# Altium schematic sheet 07_DADC.SchDoc
size 420 x 297 mm; SheetNumber: 7; SheetTotal: 12
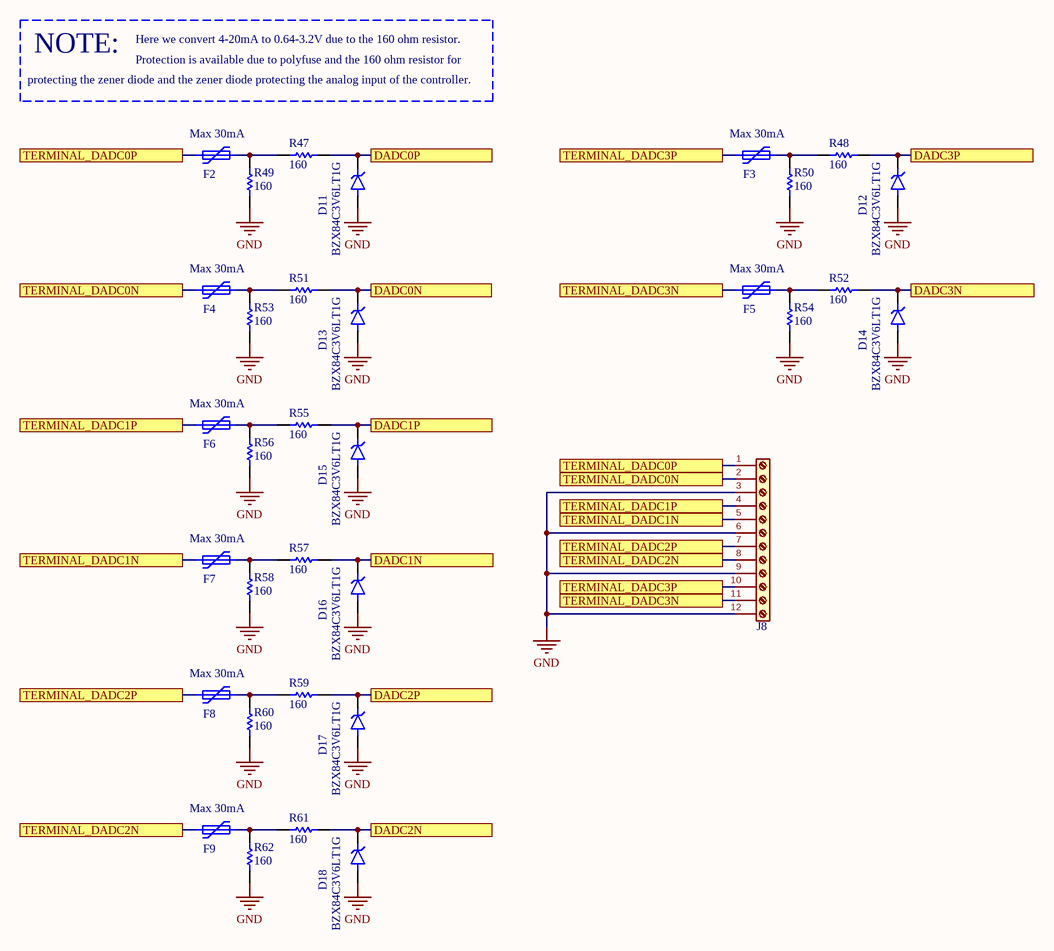
[diagram p0: 07_DADC.SchDoc]

## Parts
D11  BZX84C3V6LT1G  [SOT95P240X111-3N]
D12  BZX84C3V6LT1G  [SOT95P240X111-3N]
D13  BZX84C3V6LT1G  [SOT95P240X111-3N]
D14  BZX84C3V6LT1G  [SOT95P240X111-3N]
D15  BZX84C3V6LT1G  [SOT95P240X111-3N]
D16  BZX84C3V6LT1G  [SOT95P240X111-3N]
D17  BZX84C3V6LT1G  [SOT95P240X111-3N]
D18  BZX84C3V6LT1G  [SOT95P240X111-3N]
F2  Max 30mA  [Fuse_0603_1608Metric]
F3  Max 30mA  [Fuse_0603_1608Metric]
F4  Max 30mA  [Fuse_0603_1608Metric]
F5  Max 30mA  [Fuse_0603_1608Metric]
F6  Max 30mA  [Fuse_0603_1608Metric]
F7  Max 30mA  [Fuse_0603_1608Metric]
F8  Max 30mA  [Fuse_0603_1608Metric]
F9  Max 30mA  [Fuse_0603_1608Metric]
J8  Terminal_01x12_P5.00  [TerminalBlock_Phoenix_PT-1,5-12-5.0-H_1x12_P5.00mm_Horizontal]  (value not drawn)
R47  ValueDisplayed: 160  [0603]  (hidden comment: CRCW060320R0JNEA)
R48  ValueDisplayed: 160  [0603]  (hidden comment: CRCW060320R0JNEA)
R49  ValueDisplayed: 160  [0603]  (hidden comment: CRCW060320R0JNEA)
R50  ValueDisplayed: 160  [0603]  (hidden comment: CRCW060320R0JNEA)
R51  ValueDisplayed: 160  [0603]  (hidden comment: CRCW060320R0JNEA)
R52  ValueDisplayed: 160  [0603]  (hidden comment: CRCW060320R0JNEA)
R53  ValueDisplayed: 160  [0603]  (hidden comment: CRCW060320R0JNEA)
R54  ValueDisplayed: 160  [0603]  (hidden comment: CRCW060320R0JNEA)
R55  ValueDisplayed: 160  [0603]  (hidden comment: CRCW060320R0JNEA)
R56  ValueDisplayed: 160  [0603]  (hidden comment: CRCW060320R0JNEA)
R57  ValueDisplayed: 160  [0603]  (hidden comment: CRCW060320R0JNEA)
R58  ValueDisplayed: 160  [0603]  (hidden comment: CRCW060320R0JNEA)
R59  ValueDisplayed: 160  [0603]  (hidden comment: CRCW060320R0JNEA)
R60  ValueDisplayed: 160  [0603]  (hidden comment: CRCW060320R0JNEA)
R61  ValueDisplayed: 160  [0603]  (hidden comment: CRCW060320R0JNEA)
R62  ValueDisplayed: 160  [0603]  (hidden comment: CRCW060320R0JNEA)

## Ports
DADC0N (see 04_STM32F303VCT6[2B]), DADC0P (see 04_STM32F303VCT6[2B]), DADC1N (see 04_STM32F303VCT6[2B]), DADC1P (see 04_STM32F303VCT6[2B]), DADC2N (see 04_STM32F303VCT6[5C]), DADC2P (see 04_STM32F303VCT6[5C]), DADC3N (see 04_STM32F303VCT6[5C]), DADC3P (see 04_STM32F303VCT6[5C]), TERMINAL_DADC0N (see 07_DADC[1A]), TERMINAL_DADC0N (see 07_DADC[2B]), TERMINAL_DADC0P (see 07_DADC[1A]), TERMINAL_DADC0P (see 07_DADC[2B]), TERMINAL_DADC1N (see 07_DADC[1B]), TERMINAL_DADC1N (see 07_DADC[2B]), TERMINAL_DADC1P (see 07_DADC[1B]), TERMINAL_DADC1P (see 07_DADC[2B]), TERMINAL_DADC2N (see 07_DADC[1C]), TERMINAL_DADC2N (see 07_DADC[2B]), TERMINAL_DADC2P (see 07_DADC[1B]), TERMINAL_DADC2P (see 07_DADC[2B]), TERMINAL_DADC3N (see 07_DADC[2A]), TERMINAL_DADC3N (see 07_DADC[2B]), TERMINAL_DADC3P (see 07_DADC[2A]), TERMINAL_DADC3P (see 07_DADC[2B])

## Nets
GND: D11.1(A) D12.1(A) D13.1(A) D14.1(A) D15.1(A) D16.1(A) D17.1(A) D18.1(A) J8.3(Pin_3) J8.6(Pin_6) J8.9(Pin_9) J8.12(Pin_12) R49.1 R50.1 R53.1 R54.1 R56.1 R58.1 R60.1 R62.1
DADC0N: D13.3(K) R51.2 ; port DADC0N
DADC0P: D11.3(K) R47.2 ; port DADC0P
DADC1N: D16.3(K) R57.2 ; port DADC1N
DADC1P: D15.3(K) R55.2 ; port DADC1P
DADC2N: D18.3(K) R61.2 ; port DADC2N
DADC2P: D17.3(K) R59.2 ; port DADC2P
DADC3N: D14.3(K) R52.2 ; port DADC3N
DADC3P: D12.3(K) R48.2 ; port DADC3P
TERMINAL_DADC0N: F4.1 J8.2(Pin_2) ; port TERMINAL_DADC0N
TERMINAL_DADC0P: F2.1 J8.1(Pin_1) ; port TERMINAL_DADC0P
TERMINAL_DADC1N: F7.1 J8.5(Pin_5) ; port TERMINAL_DADC1N
TERMINAL_DADC1P: F6.1 J8.4(Pin_4) ; port TERMINAL_DADC1P
TERMINAL_DADC2N: F9.1 J8.8(Pin_8) ; port TERMINAL_DADC2N
TERMINAL_DADC2P: F8.1 J8.7(Pin_7) ; port TERMINAL_DADC2P
TERMINAL_DADC3N: F5.1 J8.11(Pin_11) ; port TERMINAL_DADC3N
TERMINAL_DADC3P: F3.1 J8.10(Pin_10) ; port TERMINAL_DADC3P
NetF2_2: F2.2 R47.1 R49.2
NetF3_2: F3.2 R48.1 R50.2
NetF4_2: F4.2 R51.1 R53.2
NetF5_2: F5.2 R52.1 R54.2
NetF6_2: F6.2 R55.1 R56.2
NetF7_2: F7.2 R57.1 R58.2
NetF8_2: F8.2 R59.1 R60.2
NetF9_2: F9.2 R61.1 R62.2

## Notes on the sheet
- Here we convert 4-20mA to 0.64-3.2V due to the 160 ohm resistor.
- protecting the zener diode and the zener diode protecting the analog input of the controller.
- NOTE:
- Protection is available due to polyfuse and the 160 ohm resistor for
- Sub-system:
- Project:
- Design by:
- Sheet title:
- Sheet
- of
- Checked by:
- Approved by:
- Doc No:
- Revision:
- Size:
- Date:
- A3

## Library data of the parts
D11-D18 = BZX84C3V6LT1G: MP: BZX84C10LT1G; Package: None; Price: None; Value: *; Availability: Unavailable
F2-F9 = Polyfuse 0603
R47-R62 = RES 160R 0603: RES, 160, 5%, 0.1 W, AEC-Q200 Grade 0, 0603; Manufacturer: Vishay-Dale; Power_W: 100mW; TempCo: 200 ppm/C; Value_Code: 20R0; Value: 20; EIA_Code: E24; SizeX_mm: 1.6; SizeY_mm: 0.8; SizeZ_mm: 1; Value2: 0.1W; SizeArea_mm2: 1.28; CompType: Resistor; AEC Qualified: Y; VDC_V: 75V; AEC Category: Q200; AEC Grade: 0; Supplier Part Number 2: 59M6784; Supplier 2: Newark; Supplier Part Number 3: 71-CRCW0603J-20-E3; Supplier 3: Mouser; RoHS: E; Value1: 5%; MountType: SMT; Supplier 1: Digi-Key; PackageReference: 0603; Tolerance_%: 5%; Res_ohm: 20; PartNumber: CRCW060320R0JNEA; ComponentLink1Description: Datasheet link; Supplier Part Number 1: 541-20GCT-ND; Technology: Thick Film; ComponentLink1URL: http://www.vishay.com/docs/20035/dcrcwe3.pdf